# EAGLE design ou6_cs-ctrl V1.0 (EAGLE 7.6.0)
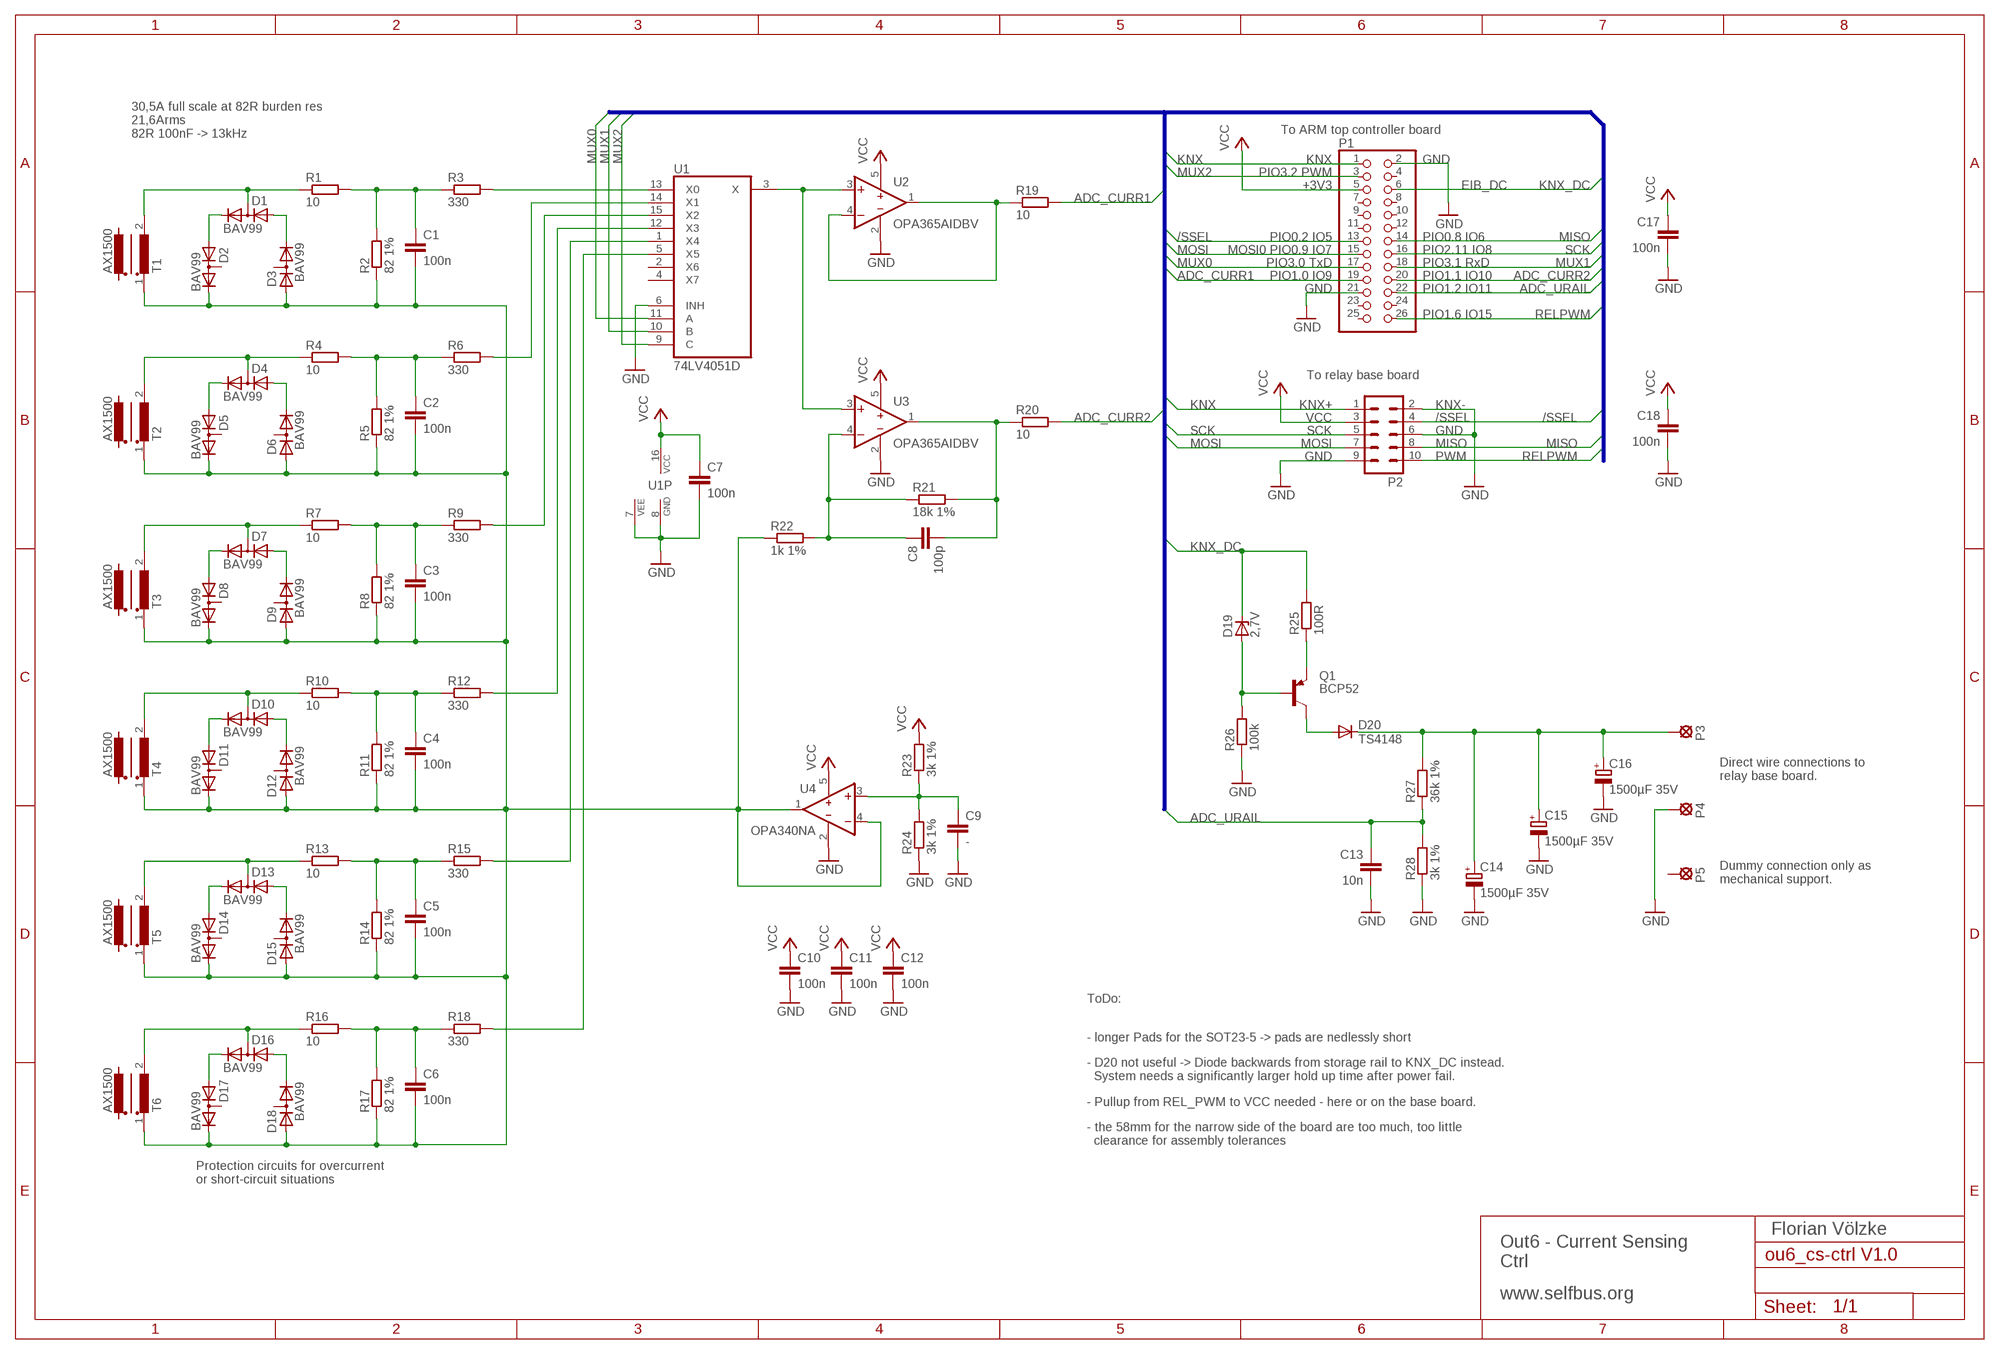
[diagram p0: schematic, sheet 1]

## Parts
C1  100n  C-EUC0805M  [R0805M]
C2  100n  C-EUC0805M  [R0805M]
C3  100n  C-EUC0805M  [R0805M]
C4  100n  C-EUC0805M  [R0805M]
C5  100n  C-EUC0805M  [R0805M]
C6  100n  C-EUC0805M  [R0805M]
C7  100n  C-EUC0805M  [R0805M]
C8  100p  C-EUC0805M  [R0805M]
C9  -  C-EUC0805M  [R0805M]
C10  100n  C-EUC0805M  [R0805M]
C11  100n  C-EUC0805M  [R0805M]
C12  100n  C-EUC0805M  [R0805M]
C13  10n  C-EUC0805M  [R0805M]
C14  1500µF 35V  CPOL-EUE5-13-30  [E5-13-30]
C15  1500µF 35V  CPOL-EUE5-13-30  [E5-13-30]
C16  1500µF 35V  CPOL-EUE5-13-30  [E5-13-30]
C17  100n  C-EUC0805M  [R0805M]
C18  100n  C-EUC0805M  [R0805M]
D1  BAV99  DIODE_2CACA-SOT23  [SOT23]
D2  BAV99  DIODE_2CACA-SOT23  [SOT23]
D3  BAV99  DIODE_2CACA-SOT23  [SOT23]
D4  BAV99  DIODE_2CACA-SOT23  [SOT23]
D5  BAV99  DIODE_2CACA-SOT23  [SOT23]
D6  BAV99  DIODE_2CACA-SOT23  [SOT23]
D7  BAV99  DIODE_2CACA-SOT23  [SOT23]
D8  BAV99  DIODE_2CACA-SOT23  [SOT23]
D9  BAV99  DIODE_2CACA-SOT23  [SOT23]
D10  BAV99  DIODE_2CACA-SOT23  [SOT23]
D11  BAV99  DIODE_2CACA-SOT23  [SOT23]
D12  BAV99  DIODE_2CACA-SOT23  [SOT23]
D13  BAV99  DIODE_2CACA-SOT23  [SOT23]
D14  BAV99  DIODE_2CACA-SOT23  [SOT23]
D15  BAV99  DIODE_2CACA-SOT23  [SOT23]
D16  BAV99  DIODE_2CACA-SOT23  [SOT23]
D17  BAV99  DIODE_2CACA-SOT23  [SOT23]
D18  BAV99  DIODE_2CACA-SOT23  [SOT23]
D19  2,7V  ZENER-DIODESOT23  [SOT23]
D20  TS4148  DIODE-MINIMELF  [MINIMELF]
P1  PINHD-2X13SMD  [2X13SMD]
P2  ML10  [ML10]
P3  SE1.5  [SE15]
P4  SE1.5  [SE15]
P5  SE1.5  [SE15]
Q1  BCP52  FZT753SMD  [SOT223]
R1  10  R-EU_R0805M  [R0805M]
R2  82 1%  R-EU_R0805M  [R0805M]
R3  330  R-EU_R0805M  [R0805M]
R4  10  R-EU_R0805M  [R0805M]
R5  82 1%  R-EU_R0805M  [R0805M]
R6  330  R-EU_R0805M  [R0805M]
R7  10  R-EU_R0805M  [R0805M]
R8  82 1%  R-EU_R0805M  [R0805M]
R9  330  R-EU_R0805M  [R0805M]
R10  10  R-EU_R0805M  [R0805M]
R11  82 1%  R-EU_R0805M  [R0805M]
R12  330  R-EU_R0805M  [R0805M]
R13  10  R-EU_R0805M  [R0805M]
R14  82 1%  R-EU_R0805M  [R0805M]
R15  330  R-EU_R0805M  [R0805M]
R16  10  R-EU_R0805M  [R0805M]
R17  82 1%  R-EU_R0805M  [R0805M]
R18  330  R-EU_R0805M  [R0805M]
R19  10  R-EU_R0805M  [R0805M]
R20  10  R-EU_R0805M  [R0805M]
R21  18k 1%  R-EU_R0805M  [R0805M]
R22  1k 1%  R-EU_R0805M  [R0805M]
R23  3k 1%  R-EU_R0805M  [R0805M]
R24  3k 1%  R-EU_R0805M  [R0805M]
R25  100R  R-EU_R0805M  [R0805M]
R26  100k  R-EU_R0805M  [R0805M]
R27  36k 1%  R-EU_R0805M  [R0805M]
R28  3k 1%  R-EU_R0805M  [R0805M]
T1  AX1500  STROMWANDLERTALEMA_AX1500  [SMALLXFORMER]
T2  AX1500  STROMWANDLERTALEMA_AX1500  [SMALLXFORMER]
T3  AX1500  STROMWANDLERTALEMA_AX1500  [SMALLXFORMER]
T4  AX1500  STROMWANDLERTALEMA_AX1500  [SMALLXFORMER]
T5  AX1500  STROMWANDLERTALEMA_AX1500  [SMALLXFORMER]
T6  AX1500  STROMWANDLERTALEMA_AX1500  [SMALLXFORMER]
U1  74LV4051D  4051D  [SO16]
U2  OPA365AIDBV  LTC2050CS5  [SOT23-5]
U3  OPA365AIDBV  LTC2050CS5  [SOT23-5]
U4  OPA340NA  LTC2050CS5  [SOT23-5]

## Nets
/SSEL: P1.13 P2.4
ADC_CURR1: P1.19 R19.2
ADC_CURR2: P1.20 R20.2
ADC_URAIL: C13.1 P1.22 R27.1 R28.2
GND: C7.2 C9.2 C10.2 C11.2 C12.2 C13.2 C14.- C15.- C16.- C17.2 C18.2 P1.2 P1.21 P2.2 P2.6 P2.9 P4.MP R24.1 R26.1 R28.1 U1.6(INH) U1.7(VEE) U1.8(GND) U2.2(V-) U3.2(V-) U4.2(V-)
KNX: P1.1 P2.1
KNX_DC: D19.3(C) P1.6 R25.2
MISO: P1.14 P2.8
MOSI: P1.15 P2.7
MUX0: P1.17 U1.11(A)
MUX1: P1.18 U1.10(B)
MUX2: P1.3 U1.9(C)
N$1: R19.1 U2.1(OUT) U2.4(-IN)
N$2: D1.3(AC) R1.1 T1.2(W1E)
N$3: D1.2(C) D2.1(A)
N$4: D1.1(A) D3.2(C)
N$5: C1.1 R1.2 R2.2 R3.1
N$6: Q1.3(E) R25.1
N$7: D4.3(AC) R4.1 T2.2(W1E)
N$8: D4.2(C) D5.1(A)
N$9: D4.1(A) D6.2(C)
N$10: C2.1 R4.2 R5.2 R6.1
N$11: C8.2 R20.1 R21.2 U3.1(OUT)
N$12: D7.3(AC) R7.1 T3.2(W1E)
N$13: D7.2(C) D8.1(A)
N$14: D7.1(A) D9.2(C)
N$15: C3.1 R7.2 R8.2 R9.1
N$16: U1.3(X) U2.3(+IN) U3.3(+IN)
N$17: D10.3(AC) R10.1 T4.2(W1E)
N$18: D10.2(C) D11.1(A)
N$19: D10.1(A) D12.2(C)
N$20: C4.1 R10.2 R11.2 R12.1
N$21: C8.1 R21.1 R22.2 U3.4(-IN)
N$22: D13.3(AC) R13.1 T5.2(W1E)
N$23: D13.2(C) D14.1(A)
N$24: D13.1(A) D15.2(C)
N$25: C5.1 R13.2 R14.2 R15.1
N$26: C1.2 C2.2 C3.2 C4.2 C5.2 C6.2 D2.2(C) D3.1(A) D5.2(C) D6.1(A) D8.2(C) D9.1(A) D11.2(C) D12.1(A) D14.2(C) D15.1(A) D17.2(C) D18.1(A) R2.1 R5.1 R8.1 R11.1 R14.1 R17.1 R22.1 T1.1(W1A) T2.1(W1A) T3.1(W1A) T4.1(W1A) T5.1(W1A) T6.1(W1A) U4.1(OUT) U4.4(-IN)
N$27: D16.3(AC) R16.1 T6.2(W1E)
N$28: D16.2(C) D17.1(A)
N$29: D16.1(A) D18.2(C)
N$30: C6.1 R16.2 R17.2 R18.1
N$31: R3.2 U1.13(X0)
N$32: R6.2 U1.14(X1)
N$33: R9.2 U1.15(X2)
N$34: R12.2 U1.12(X3)
N$35: R15.2 U1.1(X4)
N$36: R18.2 U1.5(X5)
N$37: C9.1 R23.1 R24.2 U4.3(+IN)
N$38: D20.A Q1.2(C) Q1.4(C)
N$39: C14.+ C15.+ C16.+ D20.C P3.MP R27.2
N$41: D19.1(A) Q1.1(B) R26.2
RELPWM: P1.26 P2.10
SCK: P1.16 P2.5
VCC: C7.1 C10.1 C11.1 C12.1 C17.1 C18.1 P1.5 P2.3 R23.2 U1.16(VCC) U2.5(V+) U3.5(V+) U4.5(V+)
Unconnected: D2.3(AC) D3.3(AC) D5.3(AC) D6.3(AC) D8.3(AC) D9.3(AC) D11.3(AC) D12.3(AC) D14.3(AC) D15.3(AC) D17.3(AC) D18.3(AC) P1.4 P1.7 P1.8 P1.9 P1.10 P1.11 P1.12 P1.23 P1.24 P1.25 P5.MP U1.2(X6) U1.4(X7)

## Buses
MUX[0..2],ADC_CURR[1..2],ADC_URAIL,RELPWM,/SSEL,SCK,MOSI,MISO,KNX,KNX_DC

## Notes on the sheet
- To ARM top controller board
- 30,5A full scale at 82R burden res
  21,6Arms
  82R 100nF -> 13kHz
- KNX | GND
- PIO3.2 PWM
- +3V3 | EIB_DC
- PIO0.2 IO5 | PIO0.8 IO6
- MOSI0 PIO0.9 IO7 | PIO2.11 IO8
- PIO3.0 TxD | PIO3.1 RxD
- PIO1.0 IO9 | PIO1.1 IO10
- GND | PIO1.2 IO11
- PIO1.6 IO15
- To relay base board
- KNX+ | KNX-
- VCC | /SSEL
- SCK | GND
- MOSI | MISO
- GND | PWM
- Direct wire connections to
  relay base board.
- Dummy connection only as
  mechanical support.
- ToDo:
- - longer Pads for the SOT23-5 -> pads are nedlessly short
- - D20 not useful -> Diode backwards from storage rail to KNX_DC instead.
    System needs a significantly larger hold up time after power fail.
- - Pullup from REL_PWM to VCC needed - here or on the base board.
- - the 58mm for the narrow side of the board are too much, too little
    clearance for assembly tolerances
- Protection circuits for overcurrent
  or short-circuit situations
- Out6 - Current Sensing
  Ctrl
- Florian Völzke
- www.selfbus.org

## Library data of the parts
C1-C13 C17 C18 = rcl:C-EU: CAPACITOR, European symbol
C14-C16 = rcl:CPOL-EU: POLARIZED CAPACITOR, European symbol
D1-D18 = diode:DIODE_2CACA-: 2 Diodes - Cathode-Anode|Cathode-Anode
D19 = diode:ZENER-DIODE: Z-Diode
D20 = diode:DIODE-: DIODE
P1 = pinhead:PINHD-2X13: PIN HEADER
P2 = con-harting-ml:ML10: HARTING; OC_FARNELL: unknown; OC_NEWARK: unknown
P3-P5 = solpad:SE: SOLDER PAD drill in mm
Q1 = transistor-pnp:FZT753SMD: PNP Transistor
R1-R28 = rcl:R-EU_: RESISTOR, European symbol
T1-T6 = eigene:STROMWANDLER
U1 = 40xx:4051: 8-channel ANALOG MULTIPLEXER
U2-U4 = eigene:LTC2050

## Board
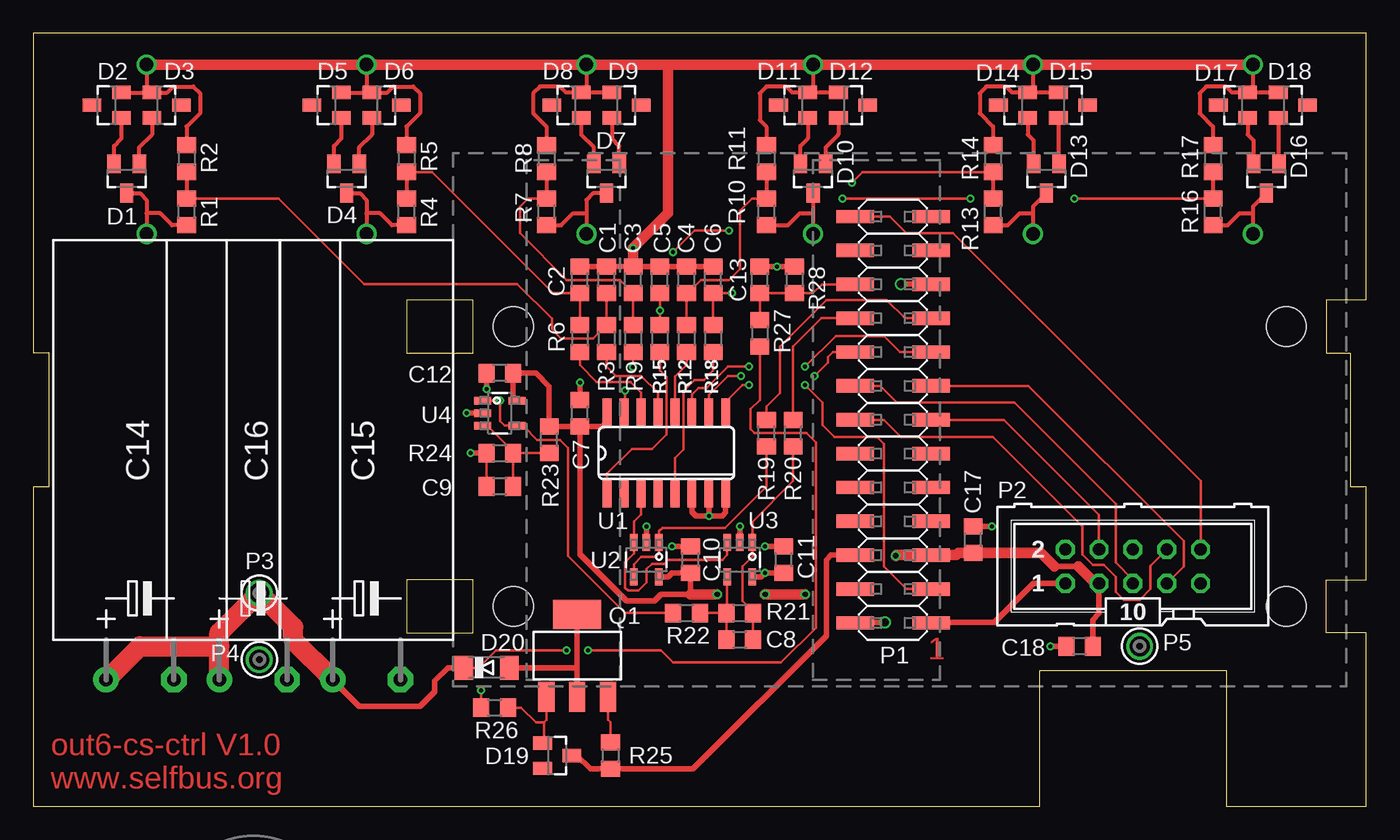
[diagram p1: board, top side]
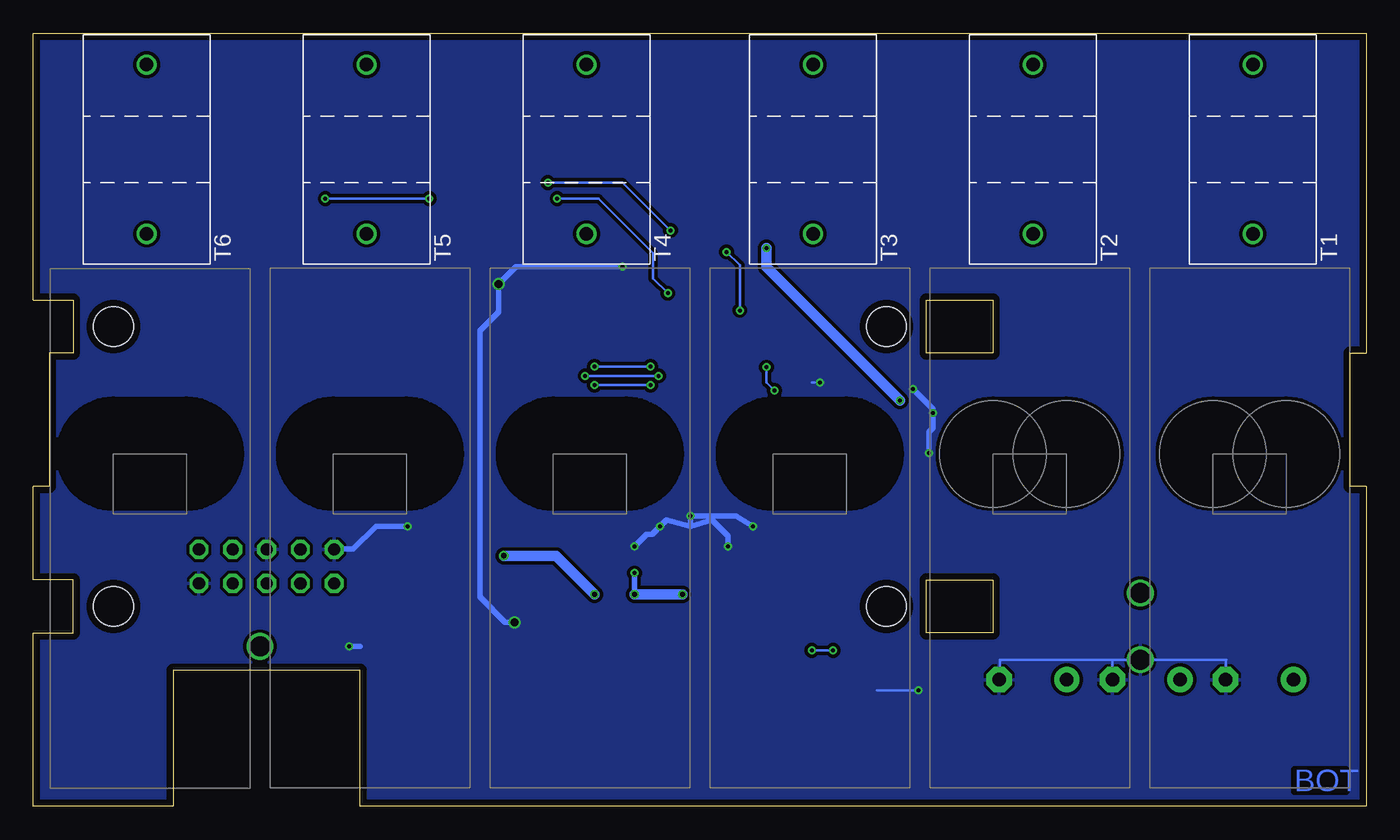
[diagram p2: board, bottom side, seen from below]

Size 100 x 58 mm. Coordinates in mm from the lower left corner, seen from the top.
Outline: 0,0 75.5,0 75.5,10.2 89.5,10.2 89.5,0 100,0 100,13 97,13 97,17 100,17 100,24 98.8,24 98.8,34 97,34 97,38 100,38 100,58 0,58 0,34 1.2,34 1.2,24 0,24 0,0
Outline: 33,38 28,38 28,34 33,34 33,38
Outline: 33,17 28,17 28,13 33,13 33,17
Copper layers (1*16): Top 0.035mm / dielectric 1.5mm / Bottom 0.035mm
Design rules "default *": minimum track width 0.2mm, minimum drill 0.3mm, track to track 0.2mm, track to pad 0.2mm, pad to pad 0.2mm, via to via 0.2mm, smd to smd 0.2mm, copper to edge 0.5mm, drill to drill 0.5mm, minimum pad ring 0.25mm, minimum via ring 0.15mm, stop-mask expansion 4mil, vias tented up to drill 0.6mm, thermal gap 0.2mm
Holes 3 mm at 94,36 94,15 36,15 36,36
bRestrict: area 2,22.4 to 15.5,30.4; area 18.5,22.4 to 32,30.4; area 35,22.4 to 48.5,30.4; area 51.5,22.4 to 65,30.4; area 68,22.4 to 81.5,30.4; area 84.5,22.4 to 98,30.4

### Footprints (pad centres in the part's own frame; a part is rotated, then mirrored left to right if it is on the bottom)
R0805M = smd 1.2 x 1.4: 1 -1,0; 2 1,0
E5-13-30 = drill 1.016 pad 1.905: + -2.54,0 | drill 1.016 pad 1.905 octagon: - 2.54,0
SOT23 = smd 1 x 1.4: 1 -0.95,-1.1; 2 0.95,-1.1; 3 0,1.1
MINIMELF = smd 1.4 x 1.8: A 1.7,0; C -1.7,0
2X13SMD = smd 1 x 2.8: 1 -15.24,-2.85; 2 -15.24,2.85; 3 -12.7,-2.85; 4 -12.7,2.85; 5 -10.16,-2.85; 6 -10.16,2.85; 7 -7.62,-2.85; 8 -7.62,2.85; 9 -5.08,-2.85; 10 -5.08,2.85; 11 -2.54,-2.85; 12 -2.54,2.85; 13 0,-2.85; 14 0,2.85; 15 2.54,-2.85; 16 2.54,2.85; 17 5.08,-2.85; 18 5.08,2.85; 19 7.62,-2.85; 20 7.62,2.85; 21 10.16,-2.85; 22 10.16,2.85; 23 12.7,-2.85; 24 12.7,2.85; 25 15.24,-2.85; 26 15.24,2.85
ML10 = drill 0.914 octagon: 1 -5.08,-1.27; 2 -5.08,1.27; 3 -2.54,-1.27; 4 -2.54,1.27; 5 0,-1.27; 6 0,1.27; 7 2.54,-1.27; 8 2.54,1.27; 9 5.08,-1.27; 10 5.08,1.27
SE15 = drill 1.5: MP 0,0
SOT223 = smd 1.219 x 2.235: 1 -2.311,-3.099; 2 0,-3.099; 3 2.311,-3.099 | smd 3.6 x 2.2: 4 0,3.099
SMALLXFORMER = drill 1.016: 1 -6.35,0; 2 6.35,0
SO16 = smd 0.66 x 2.032: 1 -4.445,-3.073; 2 -3.175,-3.073; 3 -1.905,-3.073; 4 -0.635,-3.073; 5 0.635,-3.073; 6 1.905,-3.073; 7 3.175,-3.073; 8 4.445,-3.073; 9 4.445,3.073; 10 3.175,3.073; 11 1.905,3.073; 12 0.635,3.073; 13 -0.635,3.073; 14 -1.905,3.073; 15 -3.175,3.073; 16 -4.445,3.073
SOT23-5 = smd 1.27 x 0.559: 1 -1.295,0.94; 2 -1.295,0; 3 -1.295,-0.94; 4 1.295,-0.94; 5 1.295,0.94

### Placement (x,y rotation side)
C1  43,39.5 90 top
C2  41,39.5 90 top
C3  45,39.5 90 top
C4  49,39.5 90 top
C5  47,39.5 90 top
C6  51,39.5 90 top
C7  41,29.5 90 top
C8  53,12.5 0 top
C9  35,24 180 top
C10  49.3,18.5 90 top
C11  56.3,18.5 90 top
C12  35,32.5 180 top
C13  54.5,39.5 90 top
C14  8,9.5 0 top
C15  25,9.5 0 top
C16  16.5,9.5 0 top
C17  70.5,20 90 top
C18  78.5,12 180 top
D1  7,47.1 180 top
D2  5.5,52.6 90 top
D3  10,52.6 270 top
D4  23.5,47.1 180 top
D5  22,52.6 90 top
D6  26.5,52.6 270 top
D7  43,47.1 180 top
D8  40,52.6 90 top
D9  44.5,52.6 270 top
D10  58.5,47.1 180 top
D11  57,52.6 90 top
D12  61.5,52.6 270 top
D13  76,47.1 180 top
D14  73.5,52.6 90 top
D15  78,52.6 270 top
D16  92.5,47.1 180 top
D17  90,52.6 90 top
D18  94.5,52.6 270 top
D19  39.3,3.8 270 top
D20  34,10.4 0 top
P1  64.5,29 90 top
P2  82.5,18 0 top
P3  16.95,16 0 top
P4  16.95,11 0 top
P5  83,12 0 top
Q1  40.8,11.3 0 top
R1  11.5,44.6 90 top
R2  11.5,48.6 270 top
R3  43,35.1 270 top
R4  28,44.6 90 top
R5  28,48.6 270 top
R6  41,35.1 270 top
R7  38.5,44.6 90 top
R8  38.5,48.6 270 top
R9  45,35.1 270 top
R10  55,44.6 90 top
R11  55,48.6 270 top
R12  49,35.1 270 top
R13  72,44.6 90 top
R14  72,48.6 270 top
R15  47,35.1 270 top
R16  88.5,44.6 90 top
R17  88.5,48.6 270 top
R18  51,35.1 270 top
R19  55,28 90 top
R20  57,28 90 top
R21  53,14.5 0 top
R22  49,14.5 0 top
R23  38.7,27.5 90 top
R24  35,26.5 0 top
R25  43.3,3.8 270 top
R26  34.6,7.4 0 top
R27  54.5,35.5 270 top
R28  57.1,39.5 270 top
T1  8.5,49.3 270 bottom
T2  25,49.3 270 bottom
T3  41.5,49.3 270 bottom
T4  58.5,49.3 270 bottom
T5  75,49.3 270 bottom
T6  91.5,49.3 270 bottom
U1  47.5,26.5 0 top
U2  46,18.5 270 top
U3  53,18.5 270 top
U4  OPA365AIDBV  [SOT23-5]  35,29.5 0 top

### Tracks (layer width: path | path; a pad name or v marks a point on that pad's centre or on a via)
/SSEL
  Top 0.2: P1.13 72.8,29 79.96,21.84 P2.4
ADC_CURR1
  Top 0.2: P1.19 65.38,36.62 64,38 59.5,38 56,34.5 56,31 55,30 R19.2
ADC_CURR2
  Top 0.2: P1.20 59.12,36.62 57,34.5 R20.2
ADC_URAIL
  Top 0.2: P1.22 59.16,39.16 58.5,38.5 R28.2 C13.1 R27.1
GND  (via drill 0.3, 0.6)
  Top 0.2: R26.1 v33.6,8.7 | C9.2 R24.1
  Top 0.4: C7.2 v41,31.8 | C18.2 v76.3,12 | P1.21 67.39,39.2 v65.1,39.2 | P1.2 61.69,13.8 v63.9,13.8 | U2.2 v46,21 | v50.7,21.8 50.7,22.7 50.67,22.73 U1.7 | U1.6 49.41,22.09 49.7,21.8 v50.7,21.8 | U1.8 51.95,22.05 51.7,21.8 v50.7,21.8 | C10.2 v47.9,19.5 | U3.2 v53,21 | C11.2 v54.9,19.5 | C12.2 v34,31.3 | U4.2 v32.5,29.5 | R24.1 v32.8,26.5 | C17.2 v71.9,21 | C13.2 v55.8,40.5 R28.1
  Bottom 0.2: v41,31.8 41.6,31.8 | v33.6,8.7 36.7,8.7 | C14.- 10.54,10.96 10.5,11 P4.MP 19.04,11 | 19.04,11 27.5,11 27.5,9.54 C15.- | C16.- 19.04,11
  Bottom 0.4: v76.3,12 75.5,12 | v63.9,13.8 64.6,13.8 66.5,15.7 66.5,35.7 65.1,37.1 v65.1,39.2 63.8,40.5 v55.8,40.5 | v46,21 47.3,21.8 v50.7,21.8 50.7,21 | v47.9,19.5 47.9,20.3 49.1,21.5 50.7,21 | 50.7,21 52.5,21.5 v53,21 53.6,20.4 54,20.4 v54.9,19.5 | v34,31.3 32.5,29.8 v32.5,29.5 32.5,28.4 32.8,28.1 v32.8,26.5 | v71.9,21 74.3,21 76,19.3 77.39,19.3 P2.2
  pour Bottom (isolate 0.25): 0,58 0,0 100,0 100,58
KNX
  Top 0.4: P1.1 67.96,13.76 68,13.8 72.1,13.8 75.03,16.73 P2.1
KNX_DC
  Top 0.4: P1.6 59.84,18.84 59.5,18.5 59.5,12.8 49.5,2.8 R25.2 41.8,2.8 40.8,3.8 D19.3
MISO
  Top 0.2: P1.14 63.8,29 65.1,27.7 72,27.7 78.7,21 78.7,18.9 79.5,18.1 80.3,18.1 81.2,17.2 81.2,16.1 81.8,15.5 83,15.5 83.8,16.3 83.8,18.03 P2.8
MOSI
  Top 0.2: P1.15 74.66,31.54 86.3,19.9 86.3,17.99 P2.7
MUX0  (via drill 0.3)
  Top 0.2: U1.11 49.41,30.91 49.9,31.4 50.5,31.4 52.1,33 v53.7,33 | P1.17 65.02,34.08 63.8,35.3 60.2,35.3 v57.9,33
  Bottom 0.2: v53.7,33 v57.9,33
MUX1  (via drill 0.3)
  Top 0.2: U1.10 50.67,30.88 52.1,32.3 v53.1,32.3 | P1.18 59.98,34.08 59.6,33.7 59.6,33.3 v58.6,32.3
  Bottom 0.2: v53.1,32.3 v58.6,32.3
MUX2  (via drill 0.3)
  Top 0.2: P1.3 65.5,16.3 63.8,18 63.8,27.2 63.3,27.7 60.1,27.7 59.2,28.6 59.2,30.3 v57.9,31.6 | 51.97,29.6 U1.9 52,29.63 52,30.4 53.2,31.6 v53.7,31.6
  Bottom 0.2: v57.9,31.6 v53.7,31.6
N$1
  Top 0.2: U2.4 45.06,18.16 45.6,18.7 46.7,18.7 46.94,18.94 U2.1 46.94,20.64 47.2,20.9 51.9,20.9 55,24 R19.1
N$2
  Top 0.3: D1.3 8,46 8.5,45.5 8.5,44.5 | 8.5,44.5 T1.2 | R1.1 10.4,43.6 9.5,44.5 8.5,44.5
N$3
  Top 0.3: D2.1 6.6,50.1 6.05,49.55 D1.2
N$4
  Top 0.3: D1.1 7.95,49.45 8.9,50.4 D3.2
N$5
  Top 0.2: C1.1 R3.1 42,35.1 39.6,35.1 38.9,35.8 38.9,36.6 36.3,39.2 24.8,39.2 18.4,45.6 R1.2
  Top 0.3: R2.2 R1.2
N$6
  Top 0.2: Q1.3 43.11,6.49 43.3,6.3 R25.1
N$7
  Top 0.3: D4.3 24.5,46 25,45.5 25,44.5 | 25,44.5 T2.2 | R4.1 26.9,43.6 26,44.5 25,44.5
N$8
  Top 0.3: D5.1 23.1,50.1 22.55,49.55 D4.2
N$9
  Top 0.3: D6.2 25.4,50.4 24.45,49.45 D4.1
N$10
  Top 0.2: R6.1 C2.1 39,38.5 29.9,47.6 R5.2
  Top 0.3: R5.2 R4.2
N$11
  Top 0.2: R20.1 57,24.4 53.94,21.34 U3.1 53.94,18.74 53.2,18 53.2,15.4 53.8,14.8 53.8,14.7 R21.2 C8.2
N$12
  Top 0.3: D7.3 42,46 41.5,45.5 41.5,44.5 | 41.5,44.5 T3.2 | R7.1 39.6,43.6 40.5,44.5 41.5,44.5
N$13
  Top 0.3: D8.1 41.1,50.4 42.05,49.45 D7.2
N$14
  Top 0.3: D9.2 43.4,50.1 43.95,49.55 D7.1
N$15
  Top 0.2: R9.1 C3.1 44,39.5 40,39.5 36.5,43 36.5,45 37.1,45.6 R7.2
  Top 0.3: R8.2 R7.2
N$16
  Top 0.2: U1.3 45.59,21.91 45.6,21.9 45.06,21.36 U2.3 45.06,18.96 44.4,18.3 44.4,16.4 44.6,16.2 45.4,16.2 46,16.8 46,17.8 46.4,18.2 47.3,18.2 47.6,18.5 51.7,18.5 52.06,18.86 U3.3
N$17
  Top 0.3: D10.3 58.5,44.5 | 58.5,44.5 T4.2 | R10.1 56.6,43.6 57.5,44.5 58.5,44.5
N$18
  Top 0.3: D11.1 58.1,50.1 57.55,49.55 D10.2
N$19
  Top 0.3: D12.2 60.4,50.4 59.45,49.45 D10.1
N$20
  Top 0.2: R12.1 C4.1 49.1,38.5 50.1,39.5 52.2,39.5 53,40.3 53,44.7 53.9,45.6 R10.2
  Top 0.3: R11.2 R10.2
N$21
  Top 0.2: C8.1 R21.1 | U3.4 52.06,14.56 R21.1 | R21.1 R22.2
N$22
  Top 0.3: D13.3 75,45 75,44.5 | 75,44.5 T5.2 | R13.1 73.1,43.6 74,44.5 75,44.5
N$23
  Top 0.3: D14.1 74.6,50.4 75.05,49.95 D13.2
N$24
  Top 0.3: D15.2 76.9,48.25 D13.1
N$25  (via drill 0.3)
  Top 0.2: R15.1 v47,37.2 C5.1 | v48,41.6 49.6,43.2 v52.2,43.2 | v61.4,46.8 62.2,47.6 R14.2
  Top 0.3: R14.2 R13.2
  Bottom 0.2: v47,37.2 47,40.6 v48,41.6 | v52.2,43.2 55.8,46.8 v61.4,46.8
N$26  (via drill 0.3)
  Top 0.2: U4.1 v35,30.44 35,28.9 35.34,28.56 U4.4 36.36,28.5 36.8,28.5 37.8,27.5 39.5,27.5 40.1,26.9 40.1,18.8 44.4,14.5 R22.1
  Top 0.3: D2.2 8.5,53.55 | 8.5,53.55 D3.1 10.05,53.55 10.5,54 12,54 12.5,53.5 12.5,52 11.5,51 R2.1 | T1.1 8.5,53.55 | D5.2 25,53.55 | 25,53.55 D6.1 26.55,53.55 27,54 28.5,54 29,53.5 29,52 28,51 R5.1 | T2.1 25,53.55 | D9.1 41.5,53.55 | 41.5,53.55 D8.2 39.95,53.55 39.5,54 38,54 37.5,53.5 37.5,52 38.5,51 R8.1 | T3.1 41.5,53.55 | D12.1 58.5,53.55 | 58.5,53.55 D11.2 56.95,53.55 56.5,54 55,54 54.5,53.5 54.5,51.5 55,51 R11.1 | D15.1 75,53.55 | 75,53.55 D14.2 73.45,53.55 73,54 71.5,54 71,53.5 71,52 72,51 R14.1 | D18.1 91.5,53.55 | 91.5,53.55 D17.2 89.95,53.55 89.5,54 88,54 87.5,53.5 87.5,52 88.5,51 R17.1 | T4.1 58.5,53.55 | T5.1 75,53.55 | T6.1 91.5,53.55
  Top 0.4: C2.2 C1.2 C3.2 C5.2 C4.2 C6.2
  Top 0.8: T1.1 T2.1 T3.1 47.6,55.65 | 47.6,55.65 T4.1 T5.1 T6.1 | C3.2 v45,41.9 47.6,44.5 47.6,55.65
  Bottom 0.8: v35,30.44 45,40.44 v45,41.9
N$27
  Top 0.3: D16.3 91.5,45 91.5,44.5 | 91.5,44.5 T6.2 | R16.1 89.6,43.6 90.5,44.5 91.5,44.5
N$28
  Top 0.3: D17.1 91.1,50.4 91.55,49.95 D16.2
N$29
  Top 0.3: D18.2 93.4,48.25 D16.1
N$30  (via drill 0.3)
  Top 0.2: R18.1 C6.1 v52.4,38.5 | R16.2 v78.1,45.6 | v70.3,45.6 v60.7,45.6
  Top 0.3: R17.2 R16.2
  Bottom 0.2: v78.1,45.6 v70.3,45.6 | v60.7,45.6 57.6,45.6 53.5,41.5 53.5,39.6 v52.4,38.5
N$31
  Top 0.2: R3.2 43,33 43.7,32.3 45.6,32.3 46.87,31.04 U1.13
N$32
  Top 0.2: U1.14 45.59,31.05 44.8,31.85 42.25,31.85 41,33.1 R6.2
N$33  (via drill 0.3)
  Top 0.2: R9.2 v45,32.95 | v44.4,31.2 44.4,29.5 U1.15
  Bottom 0.2: v45,32.95 45,31.8 v44.4,31.2
N$34
  Top 0.2: U1.12 48.13,32.23 49,33.1 R12.2
N$35
  Top 0.2: U1.1 43.05,24.95 44.9,26.8 46.4,26.8 47.5,27.9 47.5,32.2 47,32.7 R15.2
N$36
  Top 0.2: U1.5 48.13,26.14 48.77,26.77 48.77,31.18 49.6,32 50.3,32 51,32.7 R18.2
N$37
  Top 0.2: U4.3 34.04,28.56 35.6,27 35.6,26.9 R24.2 | R24.2 R23.1 | C9.1 R24.2
N$38
  Top 0.4: Q1.2 40.8,10.4 | 40.8,10.4 Q1.4 | D20.A 40.8,10.4
N$39  (via drill 0.3)
  Top 0.2: R27.2 54.5,30.5 53.8,29.8 53.8,28.3 54.1,28 58,28 58.7,27.3 58.7,13.4 56.1,10.8 48,10.8 47.1,11.7 v41.6,11.7 | D20.C 33.4,10.4 34.7,11.7 v40,11.7
  Top 0.4: C15.+ 24.46,7.5 29,7.5 30.1,8.6 30.1,9.4 31.1,10.4 D20.C
  Top 1: C15.+ 22.46,9.54 | C14.+ 5.5,9.5
  Top 1.5: C16.+ 13.96,12 | 13.96,12 13.96,13.01 P3.MP 19.5,13.45 19.5,12.5 22.46,9.54 | 5.5,9.5 8,12 13.96,12
  Bottom 0.2: v40,11.7 v41.6,11.7
N$41
  Top 0.2: Q1.1 38.49,6.49 38.3,6.3 | 38.3,6.3 38.3,4.85 D19.1 | R26.2 36.6,7.4 37.7,6.3 38.3,6.3
RELPWM
  Top 0.2: P1.26 64.26,44.24 65.5,43 69,43 87.58,24.42 P2.10
SCK
  Top 0.2: P1.16 63.54,31.54 64.78,30.3 73.6,30.3 81.2,22.7 81.2,18.3 82.5,17 P2.5 | P2.5 82.5,16.6 82.6,16.6 82.6,16.7 82.53,16.7 P2.5
VCC  (via drill 0.3, 0.4)
  Top 0.2: 43,28.8 43,29.52 U1.16
  Top 0.4: P2.3 79.96,14.46 79.5,14 C18.1 | U2.5 47.6,17.2 47.9,17.5 C10.1 49.3,15.9 47.1,15.9 46.6,15.4 44.5,15.4 41,18.9 C7.1 | U3.5 54.6,17.2 v54.9,17.5 C11.1 | U4.5 36,30.44 C12.1 37.7,32.5 38.7,31.5 R23.2 C7.1 | C7.1 42.7,28.5 43,28.8 | 78.4,18 76.6,18
  Top 0.8: 49.3,15.9 v51.3,15.9 | v64.7,18.8 64.74,18.84 P1.5 69.24,18.84 69.4,19 C17.1 75.6,19 76.6,18 | v57.9,15.9 v54.9,15.9 | P2.3 79.67,16.73 78.4,18
  Bottom 0.4: v54.9,17.5 v54.9,15.9
  Bottom 0.8: v51.3,15.9 v54.9,15.9 | v64.7,18.8 60.8,18.8 v57.9,15.9

### Text on the board
Top: 1 | out6-cs-ctrl V1.0 | www.selfbus.org
Bottom: BOT
tDocu: HF: Am Betaetigerausschnitt oberer Rand 1,5mm Kriechstrecke | Positionstoleranz X-Y 1,0mm | Abstand Platine zur oberen Relaiskante 3,0mm (enthält 0,5mm Höhentoleranz) | 4mm
_tsilk: 2 | 1 | 10